# Altium project Iteration2convertisseurs.PrjPcb
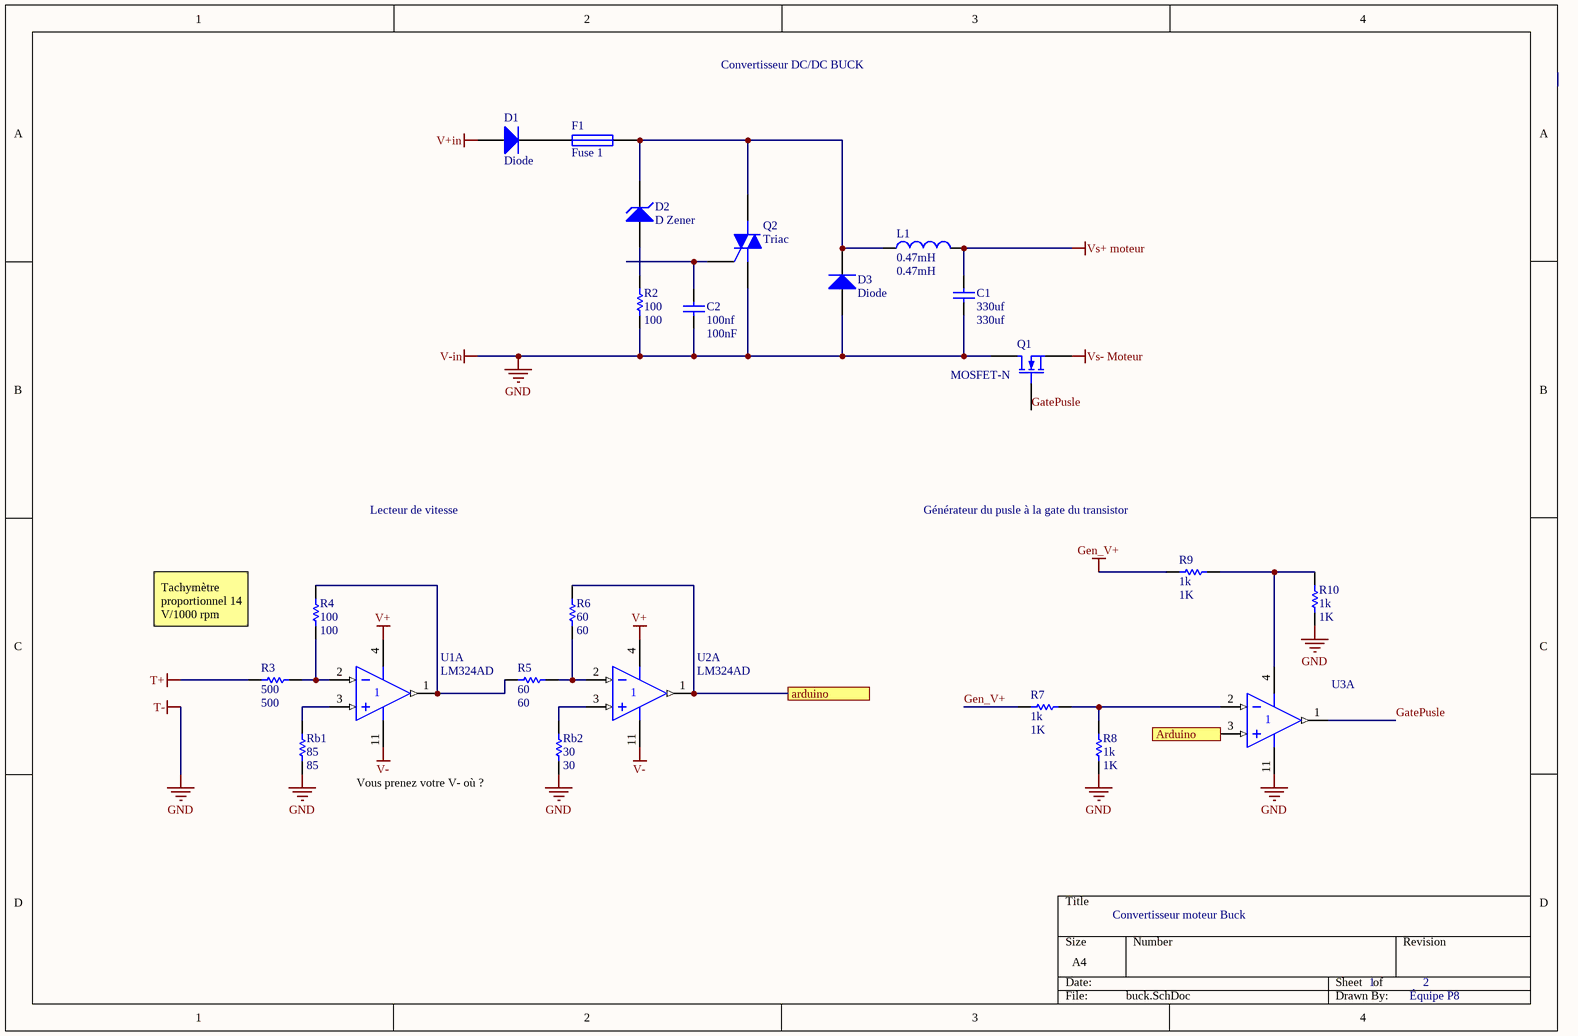
[diagram p0: buck.SchDoc]
2 sheets, 48 parts. Net scope: flat (ports and power ports of the same name join across sheets).
Sheets:
  buck.SchDoc
  Controleur_charge.SchDoc

## Sheet buck.SchDoc: Convertisseur Buck Iteration #1
size A4; SheetNumber: 1

### Parts
(Parts that share a designator on the sheet are numbered #1, #2 ... from top to bottom, then left to right.)
C1  330uf  [RAD-0.3]
C2  100nf  [RAD-0.3]
D1#1  Diode  [SMC]
D2#1  D Zener  [DIODE-0.7]
D3#1  Diode  [SMC]
F1  Fuse 1  [PIN-W2/E2.8]
L1  0.47mH  [0402-A]
Q1  MOSFET-N  [E3]
Q2  Triac  [369-03]
R2  100  [AXIAL-0.3]
R3  500  [AXIAL-0.3]
R4#1  100  [AXIAL-0.3]
R5#1  60  [AXIAL-0.3]
R6#1  60  [AXIAL-0.3]
R7#1  1k  [AXIAL-0.3]
R8#1  1k  [AXIAL-0.3]
R9#1  1k  [AXIAL-0.3]
R10#1  1k  [AXIAL-0.3]
Rb1  85  [AXIAL-0.3]
Rb2  30  [AXIAL-0.3]
U1  LM324AD  [D014_N]  (part A of 4)
U2#1  LM324AD  [D014_N]  (part A of 4)
U3#1  (no value)  [D014_N]  (part A of 4)

### Ports
arduino, Arduino

### Nets
Gen_V+: R7#1.1 R9#1.1
GND: C1.1 C2.1 D3#1.1(A) Q1.1(D) Q2.1(M1) R2.1 R8#1.1 R10#1.1 Rb1.1 Rb2.1 U3#1.11(V-)  [also labelled T-, V-in]
T+: R3.1
V+: U1.4(V+) U2#1.4(V+)
V+in: D1#1.1(A)
V-: U1.11(V-) U2#1.11(V-)
Vs+ moteur: C1.2 L1.2
Vs- Moteur: Q1.3(S)
GatePusle: Q1.2(G) U3#1.1(OUT)
NetC2_2: C2.2 Q2.3(G)
NetD1#1_2: D1#1.2(K) F1.1
NetD2#1_1: D2#1.1(A) R2.2
NetD2#1_2: D2#1.2(K) D3#1.2(K) F1.2 L1.1 Q2.2(M2)
NetR3_2: R3.2 R4#1.1 U1.2(IN-)
NetR4#1_2: R4#1.2 R5#1.1 U1.1(OUT)
NetR5#1_2: R5#1.2 R6#1.1 U2#1.2(IN-)
NetR6#1_2: R6#1.2 U2#1.1(OUT) U3#1.3(IN+) ; port arduino, port Arduino
NetR7#1_2: R7#1.2 R8#1.2 U3#1.2(IN-)
NetR9#1_2: R9#1.2 R10#1.2 U3#1.4(V+)
NetRb1_2: Rb1.2 U1.3(IN+)
NetRb2_2: Rb2.2 U2#1.3(IN+)

### Notes on the sheet
- Convertisseur DC/DC BUCK
- Lecteur de vitesse
- Générateur du pusle à la gate du transistor
- Tachymètre proportionnel 14 V/1000 rpm
- Vous prenez votre V- où ?
- Convertisseur moteur Buck
- 1
- 2
- Équipe P8

### Library data of the parts
C1 C2 = Cap: Capacitor; Published: 8-Jun-2000; LatestRevisionDate: 17-Jul-2002; LatestRevisionNote: Re-released for DXP Platform.; PackageReference: RAD-0.3; Publisher: Altium Limited; PackageDescription: Radial Cap, Thru-Hole; 2 Leads; 0.3 in Pin Spacing
  C1: Value: 330uf
  C2: Value: 100nF
D1#1 D3#1 = Diode: Default Diode; Published: 8-Jun-2000; LatestRevisionDate: 17-Jul-2002; LatestRevisionNote: Re-released for DXP Platform.; PackageVersion: Sep-1996; PackageReference: SMC; Publisher: Altium Limited; PackageDescription: DO-214-AB/SMC; 2 C-Bend Leads; Body 7.9 x 5.9 mm, inc. leads (LxW); Code_JEDEC: DO-214-AB
D2#1 = D Zener: Zener Diode; Published: 8-Jun-2000; LatestRevisionDate: 17-Jul-2002; LatestRevisionNote: Re-released for DXP Platform.; PackageReference: DIODE-0.7; Publisher: Altium Limited; PackageDescription: Diode, Thru-Hole; 2 Leads; 0.7 in Pin Spacing
F1 = Fuse 1: Fuse; Published: 8-Jun-2000; LatestRevisionDate: 17-Jul-2002; LatestRevisionNote: Re-released for DXP Platform.; PackageReference: PIN-W2/E2.8; Publisher: Altium Limited; PackageDescription: Thru-Hole; 2 Leads
L1 = Inductor: Code_IEC: 1005; Published: 8-Jun-2000; LatestRevisionDate: 29-May-2009; LatestRevisionNote: IPC-7351 Footprint Added.; PackageReference: 0402-A; Publisher: Altium Limited; PackageDescription: Chip Inductor; Code_JEITA: 0402; Value: 0.47mH
Q1 = MOSFET-N: N-Channel MOSFET; Published: 8-Jun-2000; LatestRevisionDate: 17-Jul-2002; LatestRevisionNote: Re-released for DXP Platform.; PackageVersion: 1995/1996; PackageReference: E3; Publisher: Altium Limited; PackageDescription: TO, Flat Index; 3 In-Line, Axial Leads; Body Dia. 4.6mm; Lead Dia. 0.5 mm (max)
Q2 = Triac: Silicon Bidirectional Triode Thyristor; Note: Pin 2 is electrically connected to Pin 4 (TAB); Published: 29-Sep-2000; LatestRevisionDate: 17-Jul-2002; LatestRevisionNote: Re-released for DXP Platform.; DatasheetVersion: 1999; PackageReference: 369-03; Publisher: Altium Limited; PackageDescription: TO, Thru-Hole, Vertical, Heatsink Mounted; 3 In-Line Leads; Pitch 2.28 mm; ComponentLink1Description: Manufacturer Link; ComponentLink1URL: http://www.motorola.com/
R2 R3 R4#1 R5#1 R6#1 R7#1 R8#1 R9#1 R10#1 Rb1 Rb2 = Res1: Resistor; Published: 8-Jun-2000; LatestRevisionDate: 17-Jul-2002; LatestRevisionNote: Re-released for DXP Platform.; PackageReference: AXIAL-0.3; Publisher: Altium Limited; PackageDescription: Axial Device, Thru-Hole; 2 Leads; 0.3 in Pin Spacing
  R2 R4#1: Value: 100
  R3: Value: 500
  R5#1 R6#1: Value: 60
  R7#1 R8#1 R9#1 R10#1: Value: 1K
  Rb1: Value: 85
  Rb2: Value: 30
U1 U2#1 U3#1 = LM324AD: Quadruple Operational Amplifier; Published: 15-Apr-2002; LatestRevisionDate: 13-Apr-2006; LatestRevisionNote: IPC-7351 Footprint Added.; DatasheetVersion: Jan-1989; PackageVersion: Jan-1998; PackageReference: D014; Publisher: Altium Limited; PackageDescription: 14-Pin Small Outline Integrated Circuit 1.27 mm Pitch; Code_IPC: SOIC127P600-14; ComponentLink1Description: Manufacturer Link; ComponentLink1URL: http://www.ti.com/; ComponentLink2Description: Datasheet; ComponentLink2URL: http://www-s.ti.com/sc/ds/lm324.pdf

## Sheet Controleur_charge.SchDoc
size A4
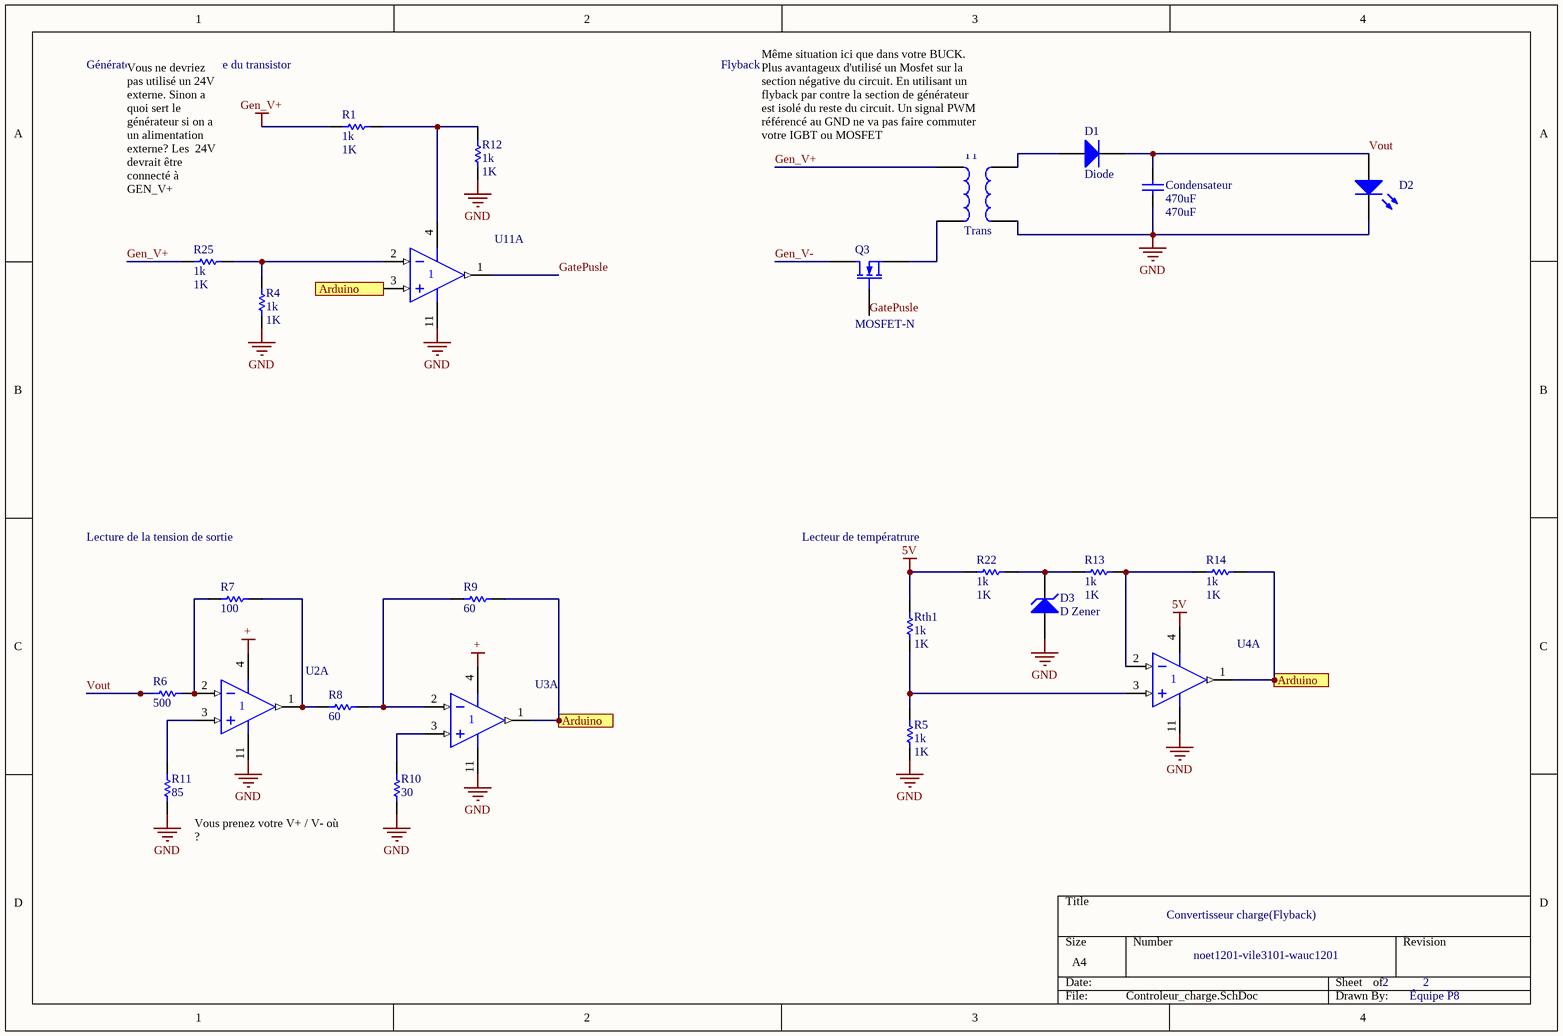
[diagram p1: Controleur_charge.SchDoc]

### Parts
(Parts that share a designator on the sheet are numbered #1, #2 ... from top to bottom, then left to right.)
Condensateur  470uF  [RAD-0.3]
D1#2  Diode  [SMC]
D2#2  (no value)  [LED-0]
D3#2  D Zener  [DIODE-0.7]
Q3  MOSFET-N  [E3]
R1  1k  [AXIAL-0.3]
R4#2  1k  [AXIAL-0.3]
R5#2  1k  [AXIAL-0.3]
R6#2  500  [AXIAL-0.3]
R7#2  100  [AXIAL-0.3]
R8#2  60  [AXIAL-0.3]
R9#2  60  [AXIAL-0.3]
R10#2  30  [AXIAL-0.3]
R11  85  [AXIAL-0.3]
R12  1k  [AXIAL-0.3]
R13  1k  [AXIAL-0.3]
R14  1k  [AXIAL-0.3]
R22  1k  [AXIAL-0.3]
R25  1k  [AXIAL-0.3]
Rth1  1k  [AXIAL-0.3]
T1  Trans  [TRANS]
U2#2  (no value)  [D014_N]  (part A of 4)
U3#2  (no value)  [D014_N]  (part A of 4)
U4  (no value)  [D014_N]  (part A of 4)
U11  (no value)  [D014_N]  (part A of 4)

### Ports
Arduino

### Nets
5V: R22.1 Rth1.2 U4.4(V+)
+: U2#2.4(V+) U3#2.4(V+)
Gen_V+: R1.1 R25.1 T1.1
GND: Condensateur.2 D2#2.2(K) D3#2.1(A) R4#2.1 R5#2.1 R10#2.1 R11.1 R12.1 T1.4 U2#2.11(V-) U3#2.11(V-) U4.11(V-) U11.11(V-)
GatePusle: Q3.2(G) U11.1(OUT)
Gen_V-: Q3.1(D)
Vout: Condensateur.1 D1#2.2(K) D2#2.1(A) R6#2.2
NetD1#2_1: D1#2.1(A) T1.3
NetD3#2_2: D3#2.2(K) R13.1 R22.2
NetQ3_3: Q3.3(S) T1.2
NetR1_2: R1.2 R12.2 U11.4(V+)
NetR4#2_2: R4#2.2 R25.2 U11.2(IN-)
NetR5#2_2: R5#2.2 Rth1.1 U4.3(IN+)
NetR6#1_2: R9#2.2 R14.2 U3#2.1(OUT) U4.1(OUT) U11.3(IN+) ; port Arduino
NetR6#2_1: R6#2.1 R7#2.1 U2#2.2(IN-)
NetR7#2_2: R7#2.2 R8#2.2 U2#2.1(OUT)
NetR8#2_1: R8#2.1 R9#2.1 U3#2.2(IN-)
NetR10#2_2: R10#2.2 U3#2.3(IN+)
NetR11_2: R11.2 U2#2.3(IN+)
NetR13_2: R13.2 R14.1 U4.2(IN-)

### Notes on the sheet
- Générateur du pusle à la gate du transistor
- Flyback
- (near T1) Même situation ici que dans votre BUCK. Plus avantageux d'utilisé un Mosfet sur la section négative du circuit. En utilisant un flyback par contre la section de générateur est isolé du reste du circuit. Un signal PWM référencé au GND ne va pas faire commuter votre IGBT ou MOSFET
- Vous ne devriez pas utilisé un 24V externe. Sinon a quoi sert le générateur si on a un alimentation externe? Les  24V devrait être connecté à GEN_V+
- Lecture de la tension de sortie
- Lecteur de températrure
- (near R11) Vous prenez votre V+ / V- où ?
- Convertisseur charge(Flyback)
- noet1201-vile3101-wauc1201
- 2
- Équipe P8

### Library data of the parts
Condensateur = Cap: Capacitor; Published: 8-Jun-2000; LatestRevisionDate: 17-Jul-2002; LatestRevisionNote: Re-released for DXP Platform.; PackageReference: RAD-0.3; Publisher: Altium Limited; PackageDescription: Radial Cap, Thru-Hole; 2 Leads; 0.3 in Pin Spacing; Value: 470uF
D1#2 = Diode: Default Diode; Published: 8-Jun-2000; LatestRevisionDate: 17-Jul-2002; LatestRevisionNote: Re-released for DXP Platform.; PackageVersion: Sep-1996; PackageReference: SMC; Publisher: Altium Limited; PackageDescription: DO-214-AB/SMC; 2 C-Bend Leads; Body 7.9 x 5.9 mm, inc. leads (LxW); Code_JEDEC: DO-214-AB
D2#2 = LED0: Typical INFRARED GaAs LED; Published: 8-Jun-2000; LatestRevisionDate: 08-Jul-2005; LatestRevisionNote: Mech Layer 1 removed.; PackageReference: LED-0; Publisher: Altium Limited; PackageDescription: LED; 2 Leads
D3#2 = D Zener: Zener Diode; Published: 8-Jun-2000; LatestRevisionDate: 17-Jul-2002; LatestRevisionNote: Re-released for DXP Platform.; PackageReference: DIODE-0.7; Publisher: Altium Limited; PackageDescription: Diode, Thru-Hole; 2 Leads; 0.7 in Pin Spacing
Q3 = MOSFET-N: N-Channel MOSFET; Published: 8-Jun-2000; LatestRevisionDate: 17-Jul-2002; LatestRevisionNote: Re-released for DXP Platform.; PackageVersion: 1995/1996; PackageReference: E3; Publisher: Altium Limited; PackageDescription: TO, Flat Index; 3 In-Line, Axial Leads; Body Dia. 4.6mm; Lead Dia. 0.5 mm (max)
R1 R4#2 R5#2 R6#2 R7#2 R8#2 R9#2 R10#2 R11-R14 R22 R25 Rth1 = Res1: Resistor; Published: 8-Jun-2000; LatestRevisionDate: 17-Jul-2002; LatestRevisionNote: Re-released for DXP Platform.; PackageReference: AXIAL-0.3; Publisher: Altium Limited; PackageDescription: Axial Device, Thru-Hole; 2 Leads; 0.3 in Pin Spacing
  R1 R4#2 R5#2 R12-R14 R22 R25 Rth1: Value: 1K
T1 = Trans: Transformer; Published: 24-Mar-1999; LatestRevisionDate: 08-Jul-2005; LatestRevisionNote: Mech Layer 1 removed.; PackageReference: TRANS; Publisher: Altium Limited; PackageDescription: Transformer; 4 Leads
U2#2 U3#2 U4 U11 = LM324AD: Quadruple Operational Amplifier; Published: 15-Apr-2002; LatestRevisionDate: 13-Apr-2006; LatestRevisionNote: IPC-7351 Footprint Added.; DatasheetVersion: Jan-1989; PackageVersion: Jan-1998; PackageReference: D014; Publisher: Altium Limited; PackageDescription: 14-Pin Small Outline Integrated Circuit 1.27 mm Pitch; Code_IPC: SOIC127P600-14; ComponentLink1Description: Manufacturer Link; ComponentLink1URL: http://www.ti.com/; ComponentLink2Description: Datasheet; ComponentLink2URL: http://www-s.ti.com/sc/ds/lm324.pdf

## Nets that join several sheets
Gen_V+: buck (R7#1.1 R9#1.1), Controleur_charge (R1.1 R25.1 T1.1)
GND: buck (11 pins), Controleur_charge (13 pins)
NetR6#1_2: buck (R6#1.2 U2#1.1 U3#1.3), Controleur_charge (5 pins)